# EAGLE design FPC_adaptor (EAGLE 9.6.2)
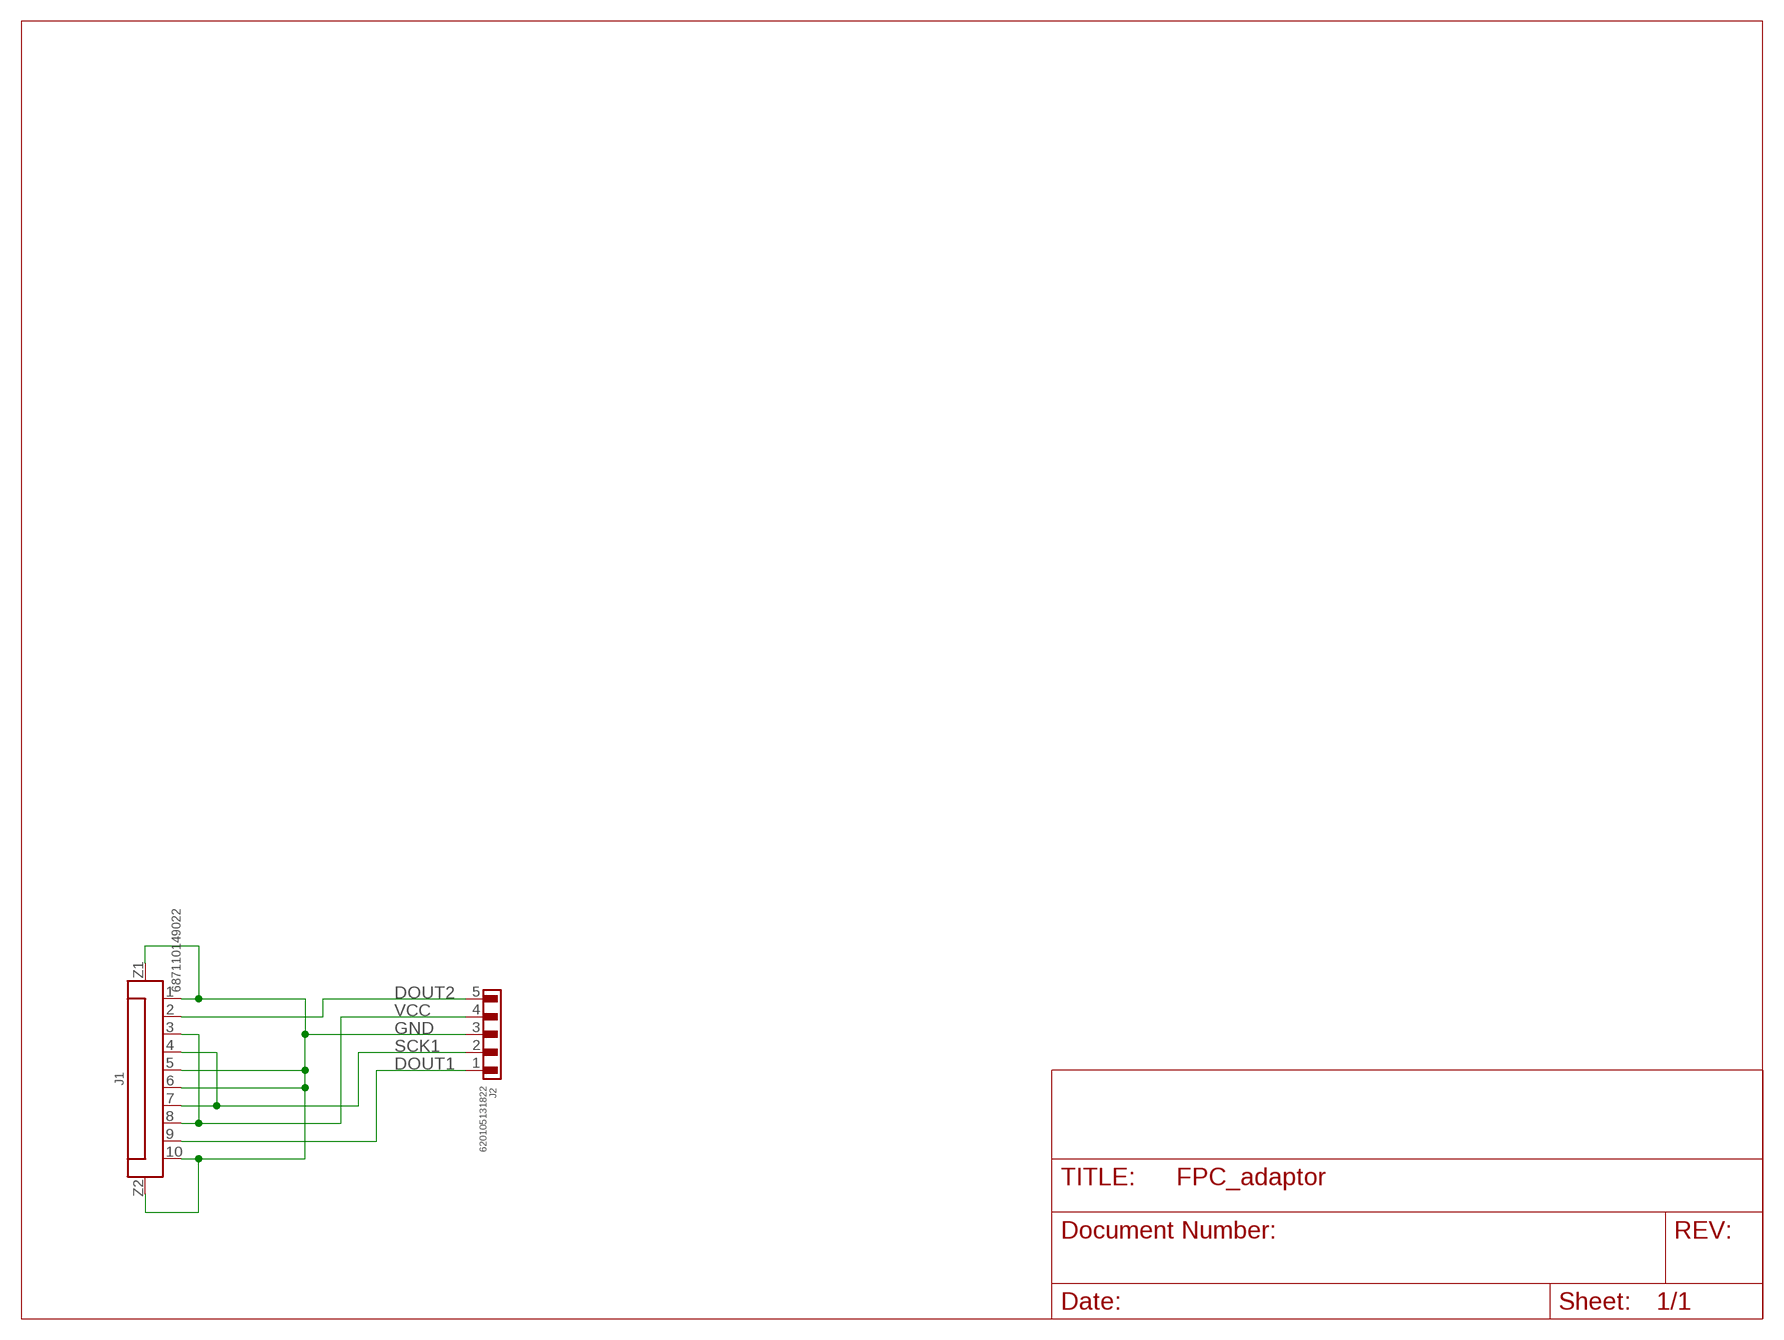
[diagram p0: schematic, sheet 1]

## Parts
J1  687110149022  6871XX149022_687110149022  [687110149022]
J2  620105131822  [620105131822]

## Nets
DOUT1: J1.9 J2.1
DOUT2: J1.2 J2.5
GND: J1.1 J1.5 J1.6 J1.10 J1.Z1 J1.Z2 J2.3
SCK1: J1.4 J1.7 J2.2
VCC: J1.3 J1.8 J2.4

## Library data of the parts
J1 = Wurth_Connectors_WR-FPC:6871XX149022_687110149022: WR-FPC 0.50 mm SMT ZIF Horizontal - Bottom Contact KIND PROPERTIES Pitch 0.5 mm MATERIAL PROPERTIES Insulator Material PA6T Contact Material Phosphor Bronze Contact Plating 120 (µ") Tin over 50 (µ") Nickel Contact Type Stamped Solder Tabs Brass <https://www.we-online.com/catalog/media/o32848v209%20Family_Con_FPC_ZIF_050_6871xx149022.jpg> Details see: https://www.we-online.com/catalog/en/FPC_0_5_SMT_ZIF_HORIZONTAL_BUTTOM_CONTACT_6871XX149022/ Updated by Ella Wu 2020-08-26 2020(C) Wurth Elektronik; CONTACT-RESISTANCE: 50mOhm; DATASHEET-URL: https://www.we-online.com/catalog/datasheet/687110149022.pdf; IR: 0.5A; L: 9.1mm; PACKAGING: Tape and Reel; PART-NUMBER: 687110149022; PINS: 10; PITCH: 0.5mm; TYPE: Horizontal; WORKING-VOLTAGE: 50V(AC)
J2 = Wurth_Connectors_WR-WTB:620105131822: WR-WTB 2.00 mm SMT Male Horizontal Shrouded Header Kind Properties Pitch 2 mm Gender Male Type Horizontal Material Properties Insulator Material PA9T Insulator Flammability Rating UL94 V-0 Insulator Color Beige Contact Material Copper Alloy Contact Plating Tin Contact Type Stamped General Information Operating Temperature -40 up to +85 °C Working Voltage 100 V (AC) Withstanding Voltage 800 V (AC) Contact Resistance 20 mΩ RISO 1000 MΩ Certification cULus Approval E323964 UL Approval E323964 Packaging Properties Packaging Tape and Reel <https://www.we-online.com/components/media/o33353v209%20Family_WR-WTB_6201xx131822.jpg> Details see: www.we-online.com/components/products/WTB_2_00_SMT_MALE_HORIZONTAL_SHROUDED_HEADER_6201XX131822 <www.we-online.com/catalog/WTB_2_00_SMT_MALE_HORIZONTAL_SHROUDED_HEADER_6201XX131822/?utm_source=eagle_model&utm_medium=description_link&utm_campaign=eisos_eagle> Updated by Ella 2023-07-05 2023 (C) Würth Elektronik; CONTACT-RESISTANCE: 20mOhm; DATASHEET-URL: https://www.we-online.com/redexpert/spec/620105131822?ae; GENDER: Male; IR: 2A; L: 14mm; MOUNT: SMT; PACKAGING: Tape and Reel; PART-NUMBER: 620105131822; PCB-CABLE-PANEL: PCB; PINS: 5; PITCH: 2mm; TYPE: Horizontal; WORKING-VOLTAGE: 100V(AC)

## Board
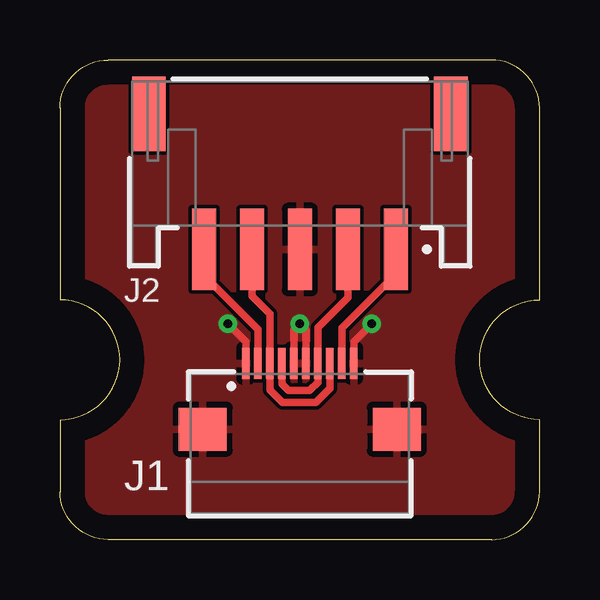
[diagram p1: board, top side]
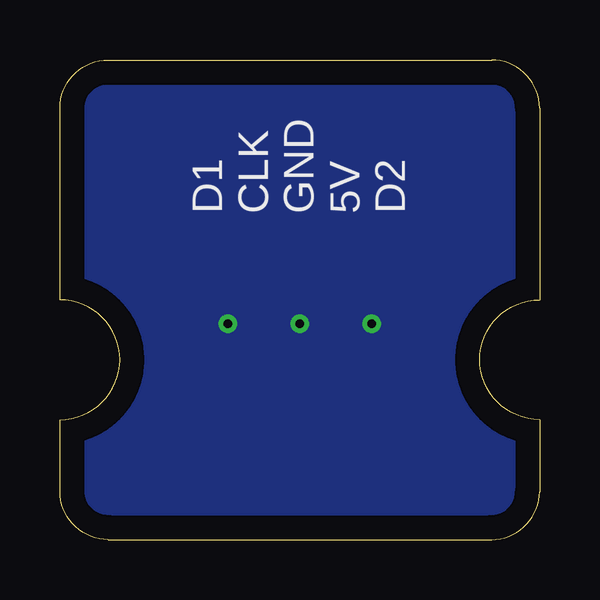
[diagram p2: board, bottom side, seen from below]

Size 20 x 20 mm. Coordinates in mm from the lower left corner, seen from the top.
Outline: 18,20 2,20 arc90 0,18 0,10 arc-180 0,5 0,2 arc90 2,0 18,0 arc90 20,2 20,5 arc-180 20,10 20,18 arc90 18,20
Copper layers (1*16): Top 0.035mm / dielectric 1.5mm / Bottom 0.035mm
Design rules "default *": minimum track width 6mil, minimum drill 0.35mm, track to track 6mil, track to pad 6mil, pad to pad 6mil, via to via 6mil, smd to smd 6mil, copper to edge 40mil, drill to drill 6mil, minimum pad ring 10mil, minimum via ring 8mil, stop-mask expansion 4mil, vias tented up to drill 100mil, thermal gap 10mil

### Footprints (pad centres in the part's own frame; a part is rotated, then mirrored left to right if it is on the bottom)
687110149022 = smd 0.3 x 1.3: 1 -2.25,3.35; 2 -1.75,3.35; 3 -1.25,3.35; 4 -0.75,3.35; 5 -0.25,3.35; 6 0.25,3.35; 7 0.75,3.35; 8 1.25,3.35; 9 1.75,3.35; 10 2.25,3.35 | smd 2 x 1.8: Z1 -4.05,0.6; Z2 4.05,0.6
620105131822 = smd 1 x 3.4: 1 -4,2.9; 2 -2,2.9; 3 0,2.9; 4 2,2.9; 5 4,2.9 | smd 1.4 x 3.1: Z1 -6.3,-2.75; Z2 6.3,-2.75

### Placement (x,y rotation side)
J1  10,4 0 top
J2  10,15 180 top

### Tracks (layer width: path | path; a pad name or v marks a point on that pad's centre or on a via)
DOUT1
  Top 0.305: J1.9 11.75,8.83 14,11.08 J2.1
DOUT2
  Top 0.305: J1.2 8.25,8.77 6,11.02 J2.5
GND  (via drill 0.35)
  Top 0.305: J1.1 7.75,8.25 v7,9 | J1.10 12.25,8.25 v13,9 | J1.5 9.75,8.75 v10,9 10.25,8.75 J1.6
  pour Bottom: 0,0 0,20 20,20 20,0
  pour Top: 0,0 0,20 20,20 20,0
SCK1
  Top 0.305: J2.2 12,10.1 10.75,8.85 J1.7 10.75,6.56 10.41,6.22 9.53,6.22 9.25,6.5 J1.4
VCC
  Top 0.305: J2.4 8,10.16 8.75,9.41 J1.3 8.75,6.24 9.27,5.71 10.67,5.71 11.25,6.3 J1.8

### Text on the board
bPlace: D1 / CLK / GND / 5V / D2